# Altium project DC-DC Senior Project.PrjPcb (part 1 of 2)
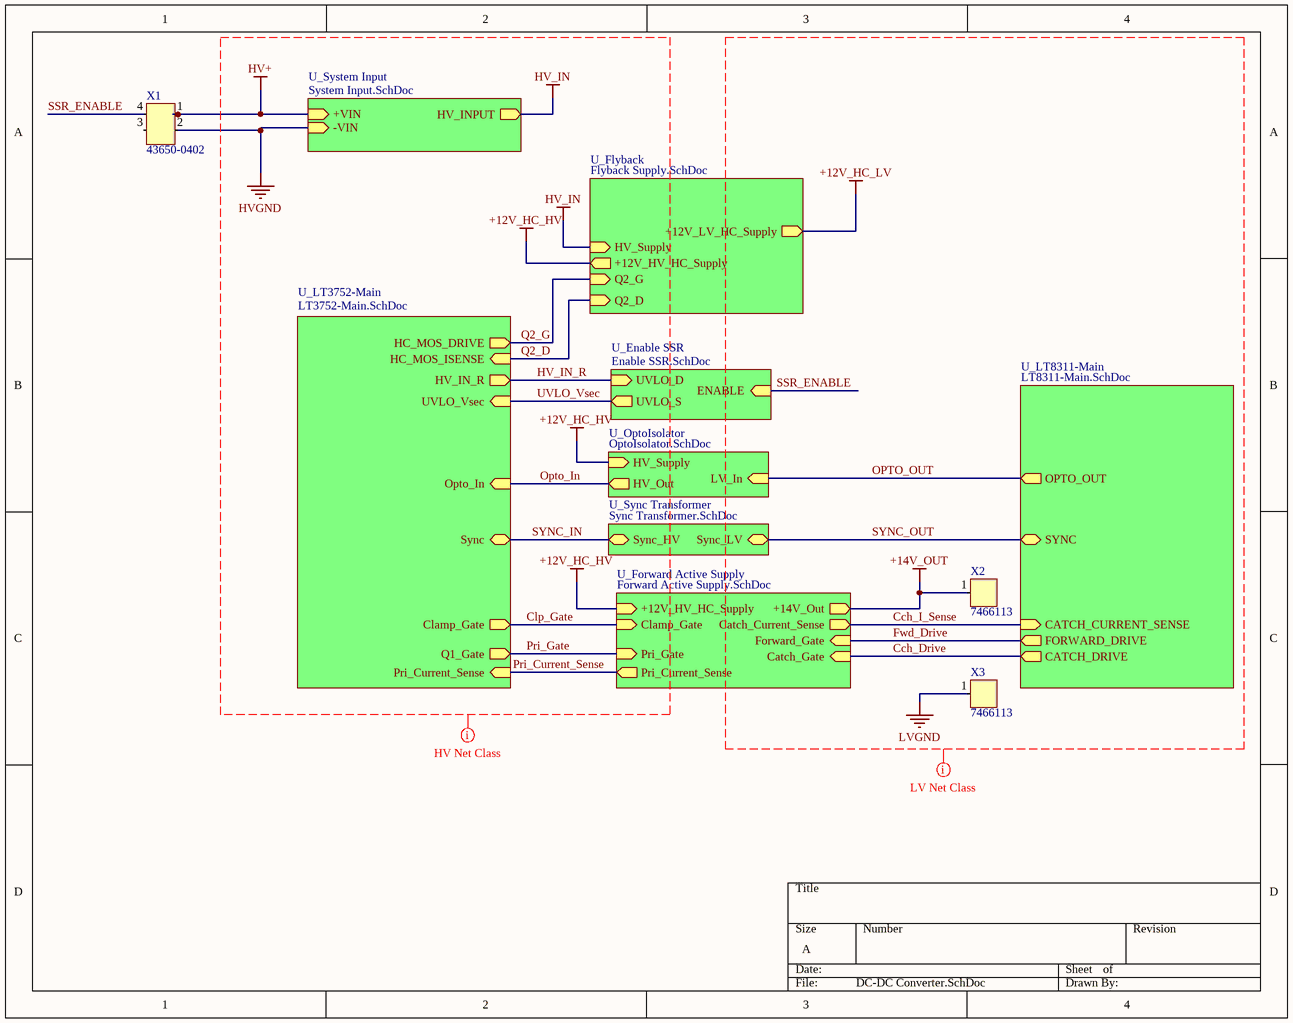
[diagram p0: DC-DC Converter.SchDoc]
10 sheets, 134 parts. Net scope: hierarchical (ports join the sheet entries above them; power ports are global).
Board file: DC-DC Converter.PcbDoc
Sheets:
  DC-DC Converter.SchDoc
    U_Sync Transformer = Sync Transformer.SchDoc
    U_OptoIsolator = OptoIsolator.SchDoc
    U_LT3752-Main = LT3752-Main.SchDoc
    U_LT8311-Main = LT8311-Main.SchDoc
    U_Flyback = Flyback Supply.SchDoc
    U_Forward Active Supply = Forward Active Supply.SchDoc
      U_Gate Driver = Gate Driver.SchDoc
    U_System Input = System Input.SchDoc
    U_Enable SSR = Enable SSR.SchDoc

## Sheet DC-DC Converter.SchDoc
size A

### Parts
X1  43650-0402  [Molex_43650_0402]
X2  7466113  [7466113]
X3  7466113  [7466113]

### Sub-sheets
U_Enable SSR = Enable SSR.SchDoc: UVLO_D (in), ENABLE (in), UVLO_S (out)
U_Flyback = Flyback Supply.SchDoc: +12V_LV_HC_Supply (out), HV_Supply (in), Q2_G (in), +12V_HV_HC_Supply (out), Q2_D (in)
U_Forward Active Supply = Forward Active Supply.SchDoc: Clamp_Gate (in), Pri_Gate (in), Pri_Current_Sense (out), +14V_Out (out), Forward_Gate (in), Catch_Gate (in), Catch_Current_Sense (out), +12V_HV_HC_Supply (in)
U_LT3752-Main = LT3752-Main.SchDoc: Sync (bidir), Opto_In (in), Q1_Gate (out), HC_MOS_DRIVE (out), HC_MOS_ISENSE (in), Clamp_Gate (out), Pri_Current_Sense (in), UVLO_Vsec (in), HV_IN_R (out)
U_LT8311-Main = LT8311-Main.SchDoc: OPTO_OUT (out), CATCH_DRIVE (out), CATCH_CURRENT_SENSE (in), FORWARD_DRIVE (out), SYNC (bidir)
U_OptoIsolator = OptoIsolator.SchDoc: HV_Supply (in), HV_Out (out), LV_In (in)
U_Sync Transformer = Sync Transformer.SchDoc: Sync_LV (bidir), Sync_HV (bidir)
U_System Input = System Input.SchDoc: +VIN (in), -VIN (in), HV_INPUT (out)

### Nets
+12V_HC_HV: sheet U_OptoIsolator/HV_Supply, sheet U_Flyback/+12V_HV_HC_Supply, sheet U_Forward Active Supply/+12V_HV_HC_Supply
+14V_OUT: X2.1 ; sheet U_Forward Active Supply/+14V_Out
HV+: X1.1 ; sheet U_System Input/+VIN
HV_IN: sheet U_Flyback/HV_Supply, sheet U_System Input/HV_INPUT
HVGND: X1.2 ; sheet U_System Input/-VIN
LVGND: X3.1
Cch_Drive: sheet U_LT8311-Main/CATCH_DRIVE, sheet U_Forward Active Supply/Catch_Gate
Cch_I_Sense: sheet U_LT8311-Main/CATCH_CURRENT_SENSE, sheet U_Forward Active Supply/Catch_Current_Sense
Clp_Gate: sheet U_LT3752-Main/Clamp_Gate, sheet U_Forward Active Supply/Clamp_Gate
Fwd_Drive: sheet U_LT8311-Main/FORWARD_DRIVE, sheet U_Forward Active Supply/Forward_Gate
HV_IN_R: sheet U_LT3752-Main/HV_IN_R, sheet U_Enable SSR/UVLO_D
Opto_In: sheet U_OptoIsolator/HV_Out, sheet U_LT3752-Main/Opto_In
OPTO_OUT: sheet U_OptoIsolator/LV_In, sheet U_LT8311-Main/OPTO_OUT
Pri_Current_Sense: sheet U_LT3752-Main/Pri_Current_Sense, sheet U_Forward Active Supply/Pri_Current_Sense
Pri_Gate: sheet U_LT3752-Main/Q1_Gate, sheet U_Forward Active Supply/Pri_Gate
Q2_D: sheet U_LT3752-Main/HC_MOS_ISENSE, sheet U_Flyback/Q2_D
Q2_G: sheet U_LT3752-Main/HC_MOS_DRIVE, sheet U_Flyback/Q2_G
SSR_ENABLE: X1.4 ; sheet U_Enable SSR/ENABLE
SYNC_IN: sheet U_Sync Transformer/Sync_HV, sheet U_LT3752-Main/Sync
SYNC_OUT: sheet U_Sync Transformer/Sync_LV, sheet U_LT8311-Main/SYNC
UVLO_Vsec: sheet U_LT3752-Main/UVLO_Vsec, sheet U_Enable SSR/UVLO_S

Not connected (* = marked no-connect by the designer): X1 3

### Layout directives
net class HV: +12V_HC_HV, Clp_Gate, HV+, HV_IN, HV_IN_R, HVGND, Opto_In, Pri_Current_Sense, Pri_Gate, Q2_D, Q2_G, SYNC_IN, UVLO_Vsec
net class LV: +12V_HC_LV, +14V_OUT, Cch_Drive, Cch_I_Sense, Fwd_Drive, LVGND, OPTO_OUT, SSR_ENABLE, SYNC_OUT

### Library data of the parts
X1 = 6: Manufacturer_id: 4; idConn: 6; Drawer_id: 1; Name: Molex 43650_0402; Value: CONN; Voltage_Rating: 600V; Pitch: 3mm; Created_By: Nick; MfrPartNo: 43650-0402; Num_Contacts: 4; Num_Rows: 1; Package: Conn; Link: https://www.digikey.com/product-detail/en/molex-llc/0436500402/WM11252-ND/3310554; ComponentLink1Description: Datasheet; ComponentLink1URL: https://www.mouser.com/datasheet/2/276/0436500402_PCB_HEADERS-148886.pdf; Supplier1: Digi-Key; Supplier1PartNo: WM11252-ND
X2 X3 = 26: 1 Pin Shank Terminal M3 Surface Mount; Manufacturer_id: 1; idConn: 26; Value: CONN; Created_By: Jason Zhou; Drawer_id: 1; Name: 7466113; Num_Contacts: 1; MfrPartNo: 7466113; Link: https://katalog.we-online.de/en/em/WP-SMSH_PIN; ComponentLink1Description: Datasheet; ComponentLink1URL: https://katalog.we-online.com/em/datasheet/7466113.pdf; Supplier1: Digi-Key; Supplier1PartNo: https://www.digikey.com/product-detail/en/wurth-electronics-inc/7466113/732-5246-ND/4733838; Created_Date: 4/19/2019

## Sheet Sync Transformer.SchDoc
size A
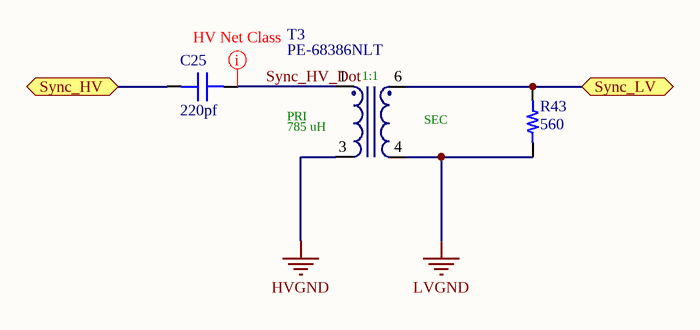
[diagram p1: Sync Transformer.SchDoc]

### Parts
C25  value 220pf  [CAP 0603/1608]  (hidden comment: Capacitor MLCC 220pf 25V CAP 0603/1608)
R43  value 560  [RES 0603/1608]  (hidden comment: Resistor 560 0603 1/10W 1%)
T3  Sync Transformer  [PE-68386NLT]  (value not drawn)

### Ports
Sync_HV (bidir), Sync_LV (bidir)

### Nets
HVGND: T3.3
LVGND: R43.1 T3.4
Sync_HV_Dot: C25.2 T3.1
SYNC_IN: C25.1 ; port Sync_HV
SYNC_OUT: R43.2 T3.6 ; port Sync_LV

### Layout directives
net class HV: Sync_HV_Dot

### Notes on the sheet
- (in symbol 2) 1:1; PRI; SEC; 785 uH

### Library data of the parts
C25 = 537: Manufacturer_id: 1; idCapacitor: 537; Name: Cap_220pf_25V_CAP 0603/1608; Dielectric: Ceramic; Created_By: Nick Mah; Drawer_id: 1; Voltage_Rating: 25V; Package: CAP 0603/1608; Created_Date: 10/20/2018
R43 = 283: Manufacturer_id: 1; idResistor: 283; Name: Res_560_0603_1/10W_1%; Created_By: Nick Mah; Supplier 1: Digi-Key; Drawer_id: 1; Tolerance: 1%; Power: 1/10W; Package: 0603; ComponentLink1Description: Datasheet; Created_Date: 2018-10-20
T3 = 2: PULSE XFMR 1:1 785UH; Manufacturer_id: 1; idTransformer: 2; Name: 500W DC-DC Sync Trfrmr; Value: 785uH - 1:1; Voltage_Primary: 380Vrms; Created_By: Nick Mah; Drawer_id: 1; Package: SMD; MfrPartNo: PE-68386NLT; Link: https://www.digikey.com/product-detail/en/pulse-electronics-power/PE-68386NLT/553-1776-1-ND/4494729; ComponentLink1Description: Datasheet; ComponentLink1URL: file:///C:/Users/Nick%20Mah/Downloads/SPM2007_61.pdf; Supplier1: Digi-Key; Supplier1PartNo: 553-1776-1-ND

## Sheet OptoIsolator.SchDoc
size A
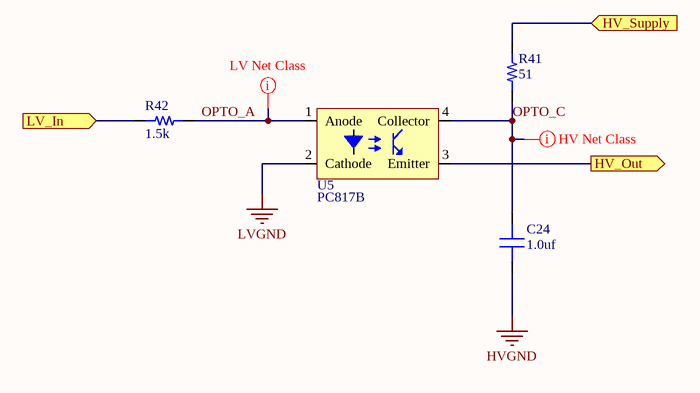
[diagram p2: OptoIsolator.SchDoc]

### Parts
C24  value 1.0uf  [CAP 0603/1608]  (hidden comment: Capacitor MLCC 1.0uf 25V CAP 0603/1608)
R41  value 51  [RES 0805/2012]  (hidden comment: Resistor 51 0805 1/4W 1%)
R42  value 1.5k  [RES 0603/1608]  (hidden comment: Resistor 1.5k 0603 1/10W 1%)
U5  PC817B  [SOIC-4]

### Ports
HV_Out (out), HV_Supply (in), LV_In (in)

### Nets
+12V_HC_HV: R41.2 ; port HV_Supply
HVGND: C24.1
LVGND: U5.2(Cathode)
OPTO_A: R42.2 U5.1(Anode)
OPTO_C: C24.2 R41.1 U5.4(Collector)
Opto_In: U5.3(Emitter) ; port HV_Out
OPTO_OUT: R42.1 ; port LV_In

### Layout directives
mark named LV Net Class: OPTO_A
net class HV: OPTO_C

### Library data of the parts
C24 = 589: Manufacturer_id: 1; idCapacitor: 589; Name: Cap_1.0uf_25V_CAP 0603/1608; Dielectric: Ceramic; Created_By: Nick Mah; Drawer_id: 1; Voltage_Rating: 25V; Package: CAP 0603/1608; Created_Date: 10/20/2018
R41 = 690: Manufacturer_id: 1; idResistor: 690; Name: Res_51_0805_1/4W_1%; Created_By: Nick Mah; Supplier 1: Digi-Key; Drawer_id: 1; Tolerance: 1%; Power: 1/4W; Package: 0805; ComponentLink1Description: Datasheet; Created_Date: 2018-10-20
R42 = 293: Manufacturer_id: 1; idResistor: 293; Name: Res_1.5k_0603_1/10W_1%; Created_By: Nick Mah; Supplier 1: Digi-Key; Drawer_id: 1; Tolerance: 1%; Power: 1/10W; Package: 0603; ComponentLink1Description: Datasheet; Created_Date: 2018-10-20
U5 = 36: Optoisolator Darlington Output 2500Vrms 1 Channel 4-SSOP; Manufacturer_id: 1; idIC_Misc: 36; Name: PS2802-1-A; Value: 90mA, 40VCe; Protocol: Null; Vin(Max): 80V Vce; Created_By: Nick Mah; Drawer_id: 1; Type: Optoisolator; Num_Circuits: 1; Package: SOIC-4; MfrPartNo: PS2802-1-A; Link: https://www.digikey.com/product-detail/en/renesas-electronics-america/PS2802-1-A/559-1102-ND/9564743; ComponentLink1Description: Datasheet; ComponentLink1URL: https://www.renesas.com/en-us/doc/YOUSYS/document/002/PN10252EJ02V0DS.pdf; Supplier1: Digi-Key; Supplier1PartNo: 559-1102-ND

## Sheet LT3752-Main.SchDoc
size A
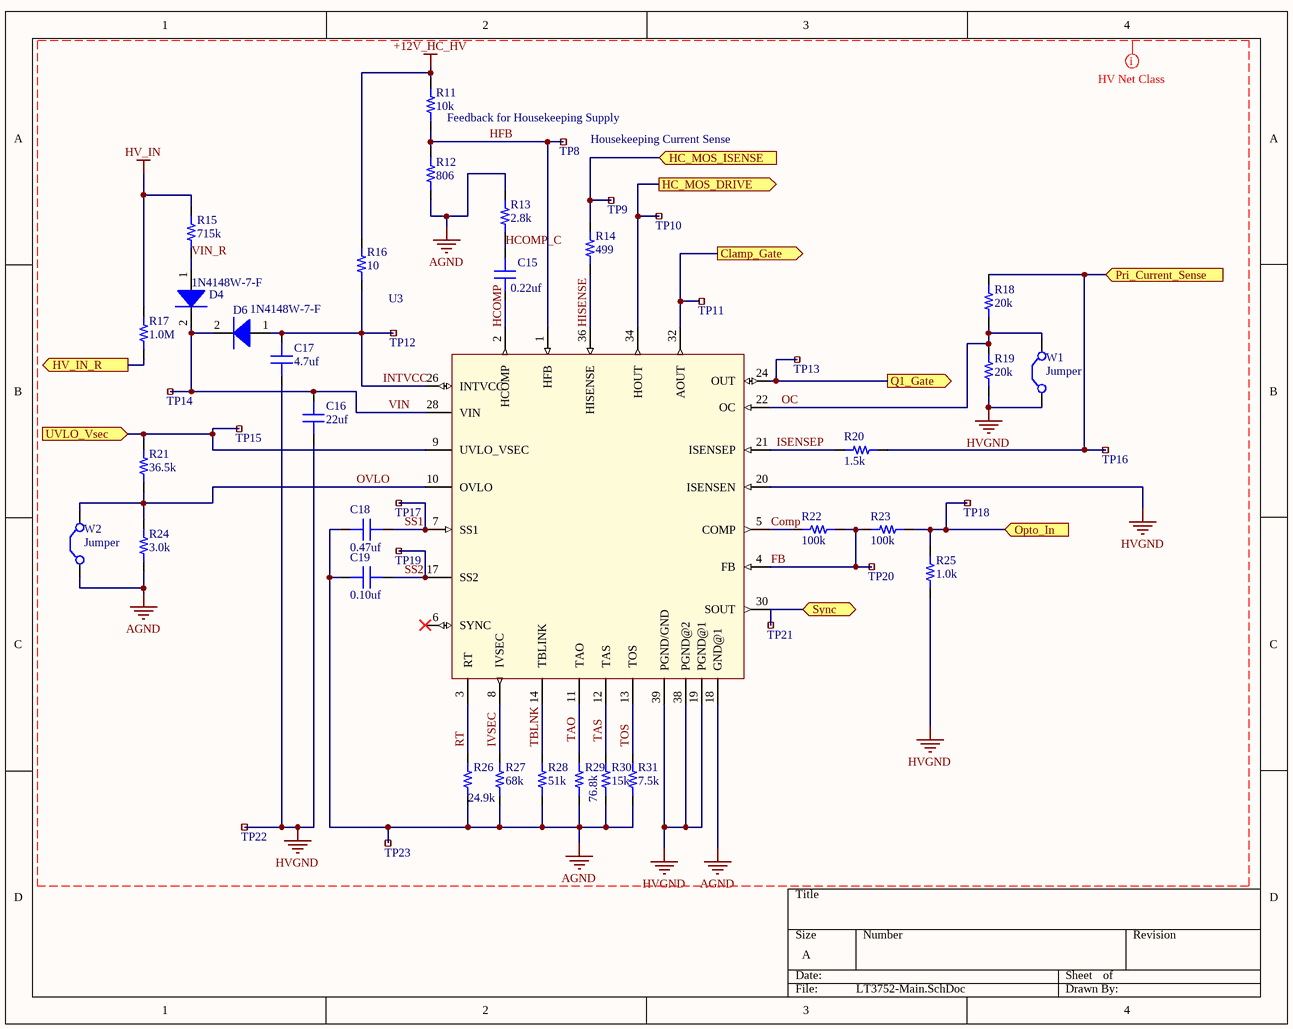
[diagram p3: LT3752-Main.SchDoc]

### Parts
C15  value 0.22uf  [CAP 0603/1608]  (hidden comment: Capacitor MLCC 0.22uf 25V CAP 0603/1608)
C16  value 22uf  [CAP 0805/2012]  (hidden comment: Capacitor MLCC 22uf 25V CAP 0805/2012)
C17  value 4.7uf  [CAP 0805/2012]  (hidden comment: Capacitor MLCC 4.7uf 25V CAP 0805/2012)
C18  value 0.47uf  [CAP 0603/1608]  (hidden comment: Capacitor MLCC 0.47uf 25V CAP 0603/1608)
C19  value 0.10uf  [CAP 0603/1608]  (hidden comment: Capacitor MLCC 0.10uf 25V CAP 0603/1608)
D4  mfrpartno: 1N4148W-7-F  [SOD123F]
D6  mfrpartno: 1N4148W-7-F  [SOD123F]
R11  value 10k  [RES 0603/1608]  (hidden comment: Resistor 10k 0603 1/10W 1%)
R12  value 806  [RES 0603/1608]  (hidden comment: Resistor 806 0603 1/10W 1%)
R13  value 2.8k  [RES 0603/1608]  (hidden comment: Resistor 2.8k 0603 1/10W 1%)
R14  value 499  [RES 0603/1608]  (hidden comment: Resistor 499 0603 1/10W 1%)
R15  value 715k  [RES 1206/3216]  (hidden comment: Resistor 715k 1206 1/4W 1%)
R16  value 10  [RES 0805/2012]  (hidden comment: Resistor 10 0805 1/4W 10%)
R17  value 1.0M  [RES 0603/1608]  (hidden comment: Resistor 1.0M 0603 1/10W 1%)
R18  value 20k  [RES 0603/1608]  (hidden comment: Resistor 20k 0603 1/10W 1%)
R19  value 20k  [RES 0603/1608]  (hidden comment: Resistor 20k 0603 1/10W 1%)
R20  value 1.5k  [RES 0603/1608]  (hidden comment: Resistor 1.5k 0603 1/10W 1%)
R21  value 36.5k  [RES 0603/1608]  (hidden comment: Resistor 36.5k 0603 1/10W 1%)
R22  value 100k  [RES 0603/1608]  (hidden comment: Resistor 100k 0603 1/10W 1%)
R23  value 100k  [RES 0603/1608]  (hidden comment: Resistor 100k 0603 1/10W 1%)
R24  value 3.0k  [RES 0603/1608]  (hidden comment: Resistor 3.0k 0603 1/10W 1%)
R25  value 1.0k  [RES 0805/2012]  (hidden comment: Resistor 1.0k 0805 1/4W 5%)
R26  value 24.9k  [RES 0603/1608]  (hidden comment: Resistor 24.9k 0603 1/10W 1%)
R27  value 68k  [RES 0603/1608]  (hidden comment: Resistor 68k 0603 1/10W 1%)
R28  value 51k  [RES 0603/1608]  (hidden comment: Resistor 51k 0603 1/10W 1%)
R29  value 76.8k  [RES 0603/1608]  (hidden comment: Resistor 76.8k 0603 1/10 1%)
R30  value 15k  [RES 0603/1608]  (hidden comment: Resistor 15k 0603 1/10W 1%)
R31  value 7.5k  [RES 0603/1608]  (hidden comment: Resistor 7.5k 0603 1/10W 1%)
TP8  RCU-0C  [5029]  (value not drawn)
TP9  RCU-0C  [5029]  (value not drawn)
TP10  RCU-0C  [5029]  (value not drawn)
TP11  RCU-0C  [5029]  (value not drawn)
TP12  RCU-0C  [5029]  (value not drawn)
TP13  RCU-0C  [5029]  (value not drawn)
TP14  RCU-0C  [5029]  (value not drawn)
TP15  RCU-0C  [5029]  (value not drawn)
TP16  RCU-0C  [5029]  (value not drawn)
TP17  RCU-0C  [5029]  (value not drawn)
TP18  RCU-0C  [5029]  (value not drawn)
TP19  RCU-0C  [5029]  (value not drawn)
TP20  RCU-0C  [5029]  (value not drawn)
TP21  RCU-0C  [5029]  (value not drawn)
TP22  RCU-0C  [5029]  (value not drawn)
TP23  RCU-0C  [5029]  (value not drawn)
U3  (no value)  [TSSOP-38]
W1  Jumper  [XG8T-0231]
W2  Jumper  [XG8T-0231]

### Ports
Clamp_Gate (out), HC_MOS_DRIVE (out), HC_MOS_ISENSE (in), HV_IN_R (out), Opto_In (in), Pri_Current_Sense (in), Q1_Gate (out), Sync (bidir), UVLO_Vsec (in)

### Nets
+12V_HC_HV: R11.1 R16.1
AGND: C18.1 C19.1 R12.1 R13.2 R24.1 R26.1 R27.1 R28.1 R29.1 R30.1 R31.1 TP23.1 U3.18(GND@1) W2.1(C1)
HV_IN: R15.2 R17.1
HVGND: C16.1 C17.1 R19.1 R25.1 TP22.1 U3.19(PGND@1) U3.20(ISENSEN) U3.38(PGND@2) U3.39(PGND/GND) W1.1(C1)
Clp_Gate: TP11.1 U3.32(AOUT) ; port Clamp_Gate
Comp: R22.1 U3.5(COMP)
FB: R22.2 R23.1 TP20.1 U3.4(FB)
HCOMP: C15.1 U3.2(HCOMP)
HCOMP_C: C15.2 R13.1
HFB: R11.2 R12.2 TP8.1 U3.1(HFB)
HISENSE: R14.1 U3.36(HISENSE)
HV_IN_R: R17.2 ; port HV_IN_R
INTVCC: C17.2 D6.1(A) R16.2 TP12.1 U3.26(INTVCC)
ISENSEP: R20.1 U3.21(ISENSEP)
IVSEC: R27.2 U3.8(IVSEC)
OC: R18.1 R19.2 U3.22(OC) W1.2(C2)
Opto_In: R23.2 R25.2 TP18.1 ; port Opto_In
OVLO: R21.1 R24.2 U3.10(OVLO) W2.2(C2)
Pri_Current_Sense: R18.2 R20.2 TP16.1 ; port Pri_Current_Sense
Pri_Gate: TP13.1 U3.24(OUT) ; port Q1_Gate
Q2_D: R14.2 TP9.1 ; port HC_MOS_ISENSE
Q2_G: TP10.1 U3.34(HOUT) ; port HC_MOS_DRIVE
RT: R26.2 U3.3(RT)
SS1: C18.2 TP17.1 U3.7(SS1)
SS2: C19.2 TP19.1 U3.17(SS2)
SYNC_IN: TP21.1 U3.30(SOUT) ; port Sync
TAO: R29.2 U3.11(TAO)
TAS: R30.2 U3.12(TAS)
TBLNK: R28.2 U3.14(TBLINK)
TOS: R31.2 U3.13(TOS)
UVLO_Vsec: R21.2 TP15.1 U3.9(UVLO_VSEC) ; port UVLO_Vsec
VIN: C16.2 D4.2(K) D6.2(K) TP14.1 U3.28(VIN)
VIN_R: D4.1(A) R15.1

Not connected (* = marked no-connect by the designer): U3 6(SYNC)*

### Layout directives
net class HV: +12V_HC_HV, AGND, Comp, FB, HCOMP, HCOMP_C, HFB, HISENSE, HV_IN, HVGND, INTVCC, ISENSEP, IVSEC, OC, OVLO, RT, SS1, SS2, TAO, TAS, TBLNK, TOS, VIN, VIN_R

### Notes on the sheet
- Feedback for Housekeeping Supply
- (near TP8) Housekeeping Current Sense

### Library data of the parts
C15 = 585: Manufacturer_id: 1; idCapacitor: 585; Name: Cap_0.22uf_25V_CAP 0603/1608; Dielectric: Ceramic; Created_By: Nick Mah; Drawer_id: 1; Voltage_Rating: 25V; Package: CAP 0603/1608; Created_Date: 10/20/2018
C16 = 717: Manufacturer_id: 1; idCapacitor: 717; Name: Cap_22uf_25V_CAP 0805/2012; Dielectric: Ceramic; Created_By: Nick Mah; Drawer_id: 1; Voltage_Rating: 25V; Package: CAP 0805/2012; Created_Date: 10/20/2018
C17 = 713: Manufacturer_id: 1; idCapacitor: 713; Name: Cap_4.7uf_25V_CAP 0805/2012; Dielectric: Ceramic; Created_By: Nick Mah; Drawer_id: 1; Voltage_Rating: 25V; Package: CAP 0805/2012; Created_Date: 10/20/2018
C18 = 587: Manufacturer_id: 1; idCapacitor: 587; Name: Cap_0.47uf_25V_CAP 0603/1608; Dielectric: Ceramic; Created_By: Nick Mah; Drawer_id: 1; Voltage_Rating: 25V; Package: CAP 0603/1608; Created_Date: 10/20/2018
C19 = 583: Manufacturer_id: 1; idCapacitor: 583; Name: Cap_0.10uf_25V_CAP 0603/1608; Dielectric: Ceramic; Created_By: Nick Mah; Drawer_id: 1; Voltage_Rating: 25V; Package: CAP 0603/1608; Created_Date: 10/20/2018
D4 D6 = 4: 100V Reverse DC Voltage; Manufacturer_id: 1; idDiode: 4; Value: Vf-1.25V,Vr-100V; Type: Standard; Ic: 300 mA; Drawer_id: 1; Name: 1N4148W-7-F; Num_Circuits: 1; Package: SOD123; Link: https://www.digikey.com/product-detail/en/diodes-incorporated/1N4148W-7-F/1N4148W-FDICT-ND/815280
R11 = 313: Manufacturer_id: 1; idResistor: 313; Name: Res_10k_0603_1/10W_1%; Created_By: Nick Mah; Supplier 1: Digi-Key; Drawer_id: 1; Tolerance: 1%; Power: 1/10W; Package: 0603; ComponentLink1Description: Datasheet; Created_Date: 2018-10-20
R12 = 2720: Manufacturer_id: 1; idResistor: 2720; Name: Res_806_0603_1/10W_1%; Created_By: Nick Mah; Supplier 1: Digi-Key; Supplier Part Number 1: Digi-Key; Drawer_id: 1; Tolerance: 1%; Power: 1/10W; Package: 0603; ComponentLink1Description: Datasheet
R13 = 2722: Manufacturer_id: 1; idResistor: 2722; Name: Res_2.8k_0603_1/10W_1%; Created_By: Nick Mah; Supplier 1: Digi-Key; Supplier Part Number 1: Digi-Key; Drawer_id: 1; Tolerance: 1%; Power: 1/10W; Package: 0603; ComponentLink1Description: Datasheet
R14 = 2723: Manufacturer_id: 1; idResistor: 2723; Name: Res_499_1/10W_1%; Created_By: Nick Mah; Supplier 1: Digi-Key; Supplier Part Number 1: Digi-Key; Drawer_id: 1; Tolerance: 1%; Power: 1/10W; Package: 0603; ComponentLink1Description: Datasheet
R15 = 2719: Manufacturer_id: 1; idResistor: 2719; Name: Res_715k_1206_1/4W_1; Created_By: Nick Mah; Supplier 1: Digi-Key; Supplier Part Number 1: Digi-Key; Drawer_id: 1; Tolerance: 1%; Power: 1/4W; Package: 1206; ComponentLink1Description: Datasheet
R16 = 2497: Manufacturer_id: 1; idResistor: 2497; Name: Res_10_0805_1/4W_10%; Created_By: Nick Mah; Supplier 1: Digi-Key; Drawer_id: 1; Tolerance: 10%; Power: 1/4W; Package: 0805; ComponentLink1Description: Datasheet; Created_Date: 2018-10-20
R17 = 361: Manufacturer_id: 1; idResistor: 361; Name: Res_1.0M_0603_1/10W_1%; Created_By: Nick Mah; Supplier 1: Digi-Key; Drawer_id: 1; Tolerance: 1%; Power: 1/10W; Package: 0603; ComponentLink1Description: Datasheet; Created_Date: 2018-10-20
R18 R19 = 320: Manufacturer_id: 1; idResistor: 320; Name: Res_20k_0603_1/10W_1%; Created_By: Nick Mah; Supplier 1: Digi-Key; Drawer_id: 1; Tolerance: 1%; Power: 1/10W; Package: 0603; ComponentLink1Description: Datasheet; Created_Date: 2018-10-20
R20 = 293: as R42 on sheet OptoIsolator; Supplier 1: Digi-Key; Drawer_id: 1; Tolerance: 1%; Power: 1/10W; Package: 0603; ComponentLink1Description: Datasheet; Created_Date: 2018-10-20
R21 = 2718: Manufacturer_id: 1; idResistor: 2718; Name: Res_36.5k_0603_1/10W_1%; Created_By: Nick Mah; Supplier 1: Digi-Key; Supplier Part Number 1: Digi-Key; Drawer_id: 1; Tolerance: 1%; Power: 1/10W; Package: 0603; ComponentLink1Description: Datasheet
R22 R23 = 337: Manufacturer_id: 1; idResistor: 337; Name: Res_100k_0603_1/10W_1%; Created_By: Nick Mah; Supplier 1: Digi-Key; Drawer_id: 1; Tolerance: 1%; Power: 1/10W; Package: 0603; ComponentLink1Description: Datasheet; Created_Date: 2018-10-20
R24 = 300: Manufacturer_id: 1; idResistor: 300; Name: Res_3.0k_0603_1/10W_1%; Created_By: Nick Mah; Supplier 1: Digi-Key; Drawer_id: 1; Tolerance: 1%; Power: 1/10W; Package: 0603; ComponentLink1Description: Datasheet; Created_Date: 2018-10-20
R25 = 1801: Manufacturer_id: 1; idResistor: 1801; Name: Res_1.0k_0805_1/4W_5%; Created_By: Nick Mah; Supplier 1: Digi-Key; Drawer_id: 1; Tolerance: 5%; Power: 1/4W; Package: 0805; ComponentLink1Description: Datasheet; Created_Date: 2018-10-20
R26 = 2716: Manufacturer_id: 1; idResistor: 2716; Name: Res_24.9k_0603_1/10W_1%; Created_By: Nick Mah; Supplier 1: Digi-Key; Supplier Part Number 1: Digi-Key; Drawer_id: 1; Tolerance: 1%; Power: 1/10W; Package: 0603; ComponentLink1Description: Datasheet
R27 = 333: Manufacturer_id: 1; idResistor: 333; Name: Res_68k_0603_1/10W_1%; Created_By: Nick Mah; Supplier 1: Digi-Key; Drawer_id: 1; Tolerance: 1%; Power: 1/10W; Package: 0603; ComponentLink1Description: Datasheet; Created_Date: 2018-10-20
R28 = 330: Manufacturer_id: 1; idResistor: 330; Name: Res_51k_0603_1/10W_1%; Created_By: Nick Mah; Supplier 1: Digi-Key; Drawer_id: 1; Tolerance: 1%; Power: 1/10W; Package: 0603; ComponentLink1Description: Datasheet; Created_Date: 2018-10-20
R29 = 2717: Manufacturer_id: 1; idResistor: 2717; Name: Res_76.8k_0603_1/10W_1%; Power: 1/10W; Created_By: Nick Mah; Supplier 1: Digi-Key; Supplier Part Number 1: Digi-Key; Drawer_id: 1; Tolerance: 1%; Package: 0603; ComponentLink1Description: Datasheet
R30 = 317: Manufacturer_id: 1; idResistor: 317; Name: Res_15k_0603_1/10W_1%; Created_By: Nick Mah; Supplier 1: Digi-Key; Drawer_id: 1; Tolerance: 1%; Power: 1/10W; Package: 0603; ComponentLink1Description: Datasheet; Created_Date: 2018-10-20
R31 = 310: Manufacturer_id: 1; idResistor: 310; Name: Res_7.5k_0603_1/10W_1%; Created_By: Nick Mah; Supplier 1: Digi-Key; Drawer_id: 1; Tolerance: 1%; Power: 1/10W; Package: 0603; ComponentLink1Description: Datasheet; Created_Date: 2018-10-20
TP8-TP23 = 28: Test point; Manufacturer_id: 1; idConn: 28; Value: CONN; Created_By: Jason Zhou; Drawer_id: 1; Name: 5029; Num_Contacts: 1; Num_Rows: 1; Package: 5029; MfrPartNo: 5029; Link: https://www.digikey.com/product-detail/en/keystone-electronics/5029/36-5029CT-ND/5980631; ComponentLink1Description: Datasheet; ComponentLink1URL: file:///C:/Users/Jason%20Zhou/Downloads/5029.PDF; Supplier1: Digi-Key; Supplier1PartNo: 36-5029CT-ND; Created_Date: 4/26/2019
U3 = 3: Forward Converter Regulator Positive, Isolation Capable Output Step-Up/Step-Down DC-DC Controller IC 6.5-100V Input; Manufacturer_id: 1; MfrPartNo: LT3752FE-1; MF: Linear Technology/Analog; MP: LT3752EFE-1#PBF; idPMIC_SW: 3; Name: LT3752-1 DC-DC Converter; Discrete: No; Power: 400W; Topology: Isolated Forward; Vin(Min): 6.5V; Vin(Max): 100V; Vout_Type: Adjustable; Fs: 100-500kHz; Created_By: Jason; Availability: Unavailable; Price: None; Package: 38-TSSOP; SnapEDA_Link: https://www.snapeda.com/parts/LT3752EFE-1%23PBF/Analog%20Devices/view-part/?ref=snap; Value: Forward; Drawer_id: 1; Num_Outputs: 1; Link: https://www.digikey.com/product-detail/en/linear-technology-analog-devices/LT3752EFE-1-PBF/LT3752EFE-1-PBF-ND/4814575; ComponentLink1Description: Datasheet; ComponentLink1URL: https://www.analog.com/media/en/technical-documentation/data-sheets/8311f.pdf; Supplier1: Digi-Key; Supplier1PartNo: LT3752EFE-1#PBF-ND
W1 W2 = 18: Jumper headers; Manufacturer_id: 1; idFuse: 3; idConn: 18; Num_Contacts: 2; Pitch: .1 mm; Drawer_id: 1; Name: XG8T-0231; Value: Jumper; Num_Rows: 1; MfrPartNo: XG8T-0231; Link: https://www.digikey.ca/product-detail/en/omron-electronics-inc-emc-div/XG8T-0231/XG8T-0231-ND/1829453; ComponentLink1Description: Datasheet; Supplier1: Digi-Key

## Sheet LT8311-Main.SchDoc
size A
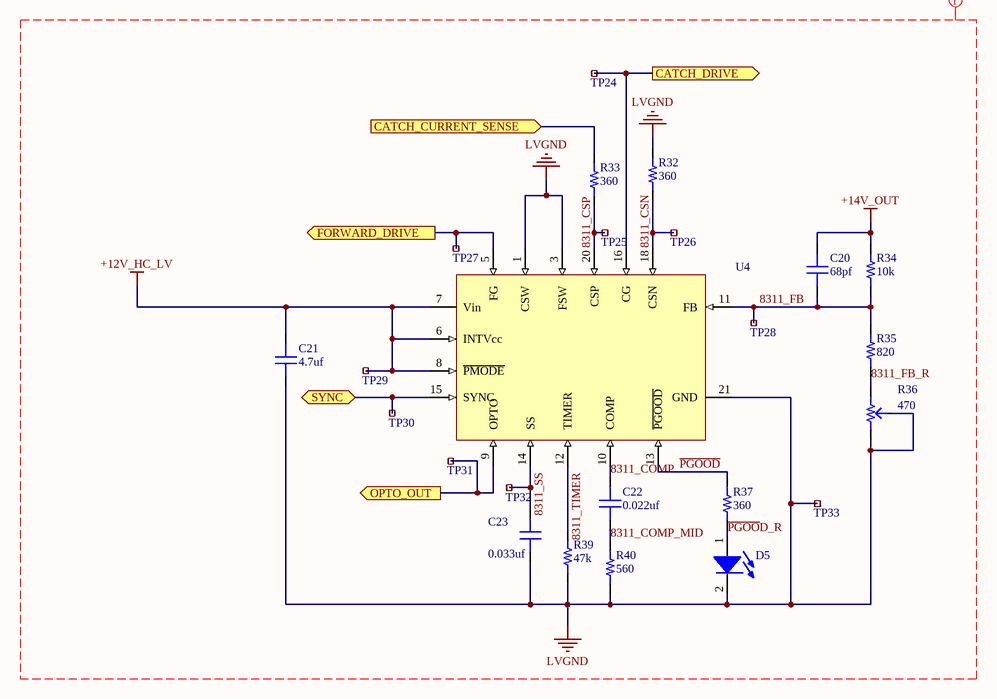
[diagram p4: LT8311-Main.SchDoc]

### Parts
C20  value 68pf  [CAP 0603/1608]  (hidden comment: Capacitor MLCC 68pf 25V CAP 0603/1608)
C21  value 4.7uf  [CAP 0805/2012]  (hidden comment: Capacitor MLCC 4.7uf 25V CAP 0805/2012)
C22  value 0.022uf  [CAP 0603/1608]  (hidden comment: Capacitor MLCC 0.022uf 16V CAP 0603/1608)
C23  value 0.033uf  [CAP 0603/1608]  (hidden comment: Capacitor MLCC 0.033uf 16V CAP 0603/1608)
D5  (no value)  [0805_LED]
R32  value 360  [RES 0603/1608]  (hidden comment: Resistor 360 0603 1/10W 1%)
R33  value 360  [RES 0603/1608]  (hidden comment: Resistor 360 0603 1/10W 1%)
R34  value 10k  [RES 0603/1608]  (hidden comment: Resistor 10k 0603 1/10W 1%)
R35  value 820  [RES 0603/1608]  (hidden comment: Resistor 820 0603 1/10W 1%)
R36  value 470  [PT6WV]  (hidden comment: TRIMMER 470 OHM LINEAR)
R37  value 360  [RES 0603/1608]  (hidden comment: Resistor 360 0603 1/10W 1%)
R39  value 47k  [RES 0603/1608]  (hidden comment: Resistor 47k 0603 1/10W 1%)
R40  value 560  [RES 0603/1608]  (hidden comment: Resistor 560 0603 1/10W 1%)
TP24  RCU-0C  [5029]  (value not drawn)
TP25  RCU-0C  [5029]  (value not drawn)
TP26  RCU-0C  [5029]  (value not drawn)
TP27  RCU-0C  [5029]  (value not drawn)
TP28  RCU-0C  [5029]  (value not drawn)
TP29  RCU-0C  [5029]  (value not drawn)
TP30  RCU-0C  [5029]  (value not drawn)
TP31  RCU-0C  [5029]  (value not drawn)
TP32  RCU-0C  [5029]  (value not drawn)
TP33  RCU-0C  [5029]  (value not drawn)
U4  (no value)  [FE20(16)]

### Ports
CATCH_CURRENT_SENSE (in), CATCH_DRIVE (out), FORWARD_DRIVE (out), OPTO_OUT (out), SYNC (bidir)

### Nets
+12V_HC_LV: C21.2 TP29.1 U4.6(INTVcc) U4.7(Vin) U4.8(~{PMODE})
+14V_OUT: C20.2 R34.2
LVGND: C21.1 C23.2 D5.2(K) R32.2 R36.2 R39.1 R40.1 TP33.1 U4.1(CSW) U4.3(FSW) U4.21(GND)
8311_COMP: C22.2 U4.10(COMP)
8311_COMP_MID: C22.1 R40.2
8311_CSN: R32.1 TP26.1 U4.18(CSN)
8311_CSP: R33.1 TP25.1 U4.20(CSP)
8311_FB: C20.1 R34.1 R35.2 TP28.1 U4.11(FB)
8311_FB_R: R35.1 R36.1
8311_SS: C23.1 TP32.1 U4.14(SS)
8311_TIMER: R39.2 U4.12(TIMER)
Cch_Drive: TP24.1 U4.16(CG) ; port CATCH_DRIVE
Cch_I_Sense: R33.2 ; port CATCH_CURRENT_SENSE
Fwd_Drive: TP27.1 U4.5(FG) ; port FORWARD_DRIVE
OPTO_OUT: TP31.1 U4.9(OPTO) ; port OPTO_OUT
~{PGOOD}: R37.2 U4.13(~{PGOOD})
~{PGOO}D_R: D5.1(A) R37.1
SYNC_OUT: TP30.1 U4.15(SYNC) ; port SYNC

Not connected (* = marked no-connect by the designer): R36 3

### Layout directives
net class LV: 8311_COMP, 8311_COMP_MID, 8311_CSN, 8311_CSP, 8311_FB, 8311_FB_R, 8311_SS, 8311_TIMER, +12V_HC_LV, +14V_OUT, LVGND, ~{PGOOD}, ~{PGOO}D_R

### Library data of the parts
C20 = 525: Manufacturer_id: 1; idCapacitor: 525; Name: Cap_68pf_25V_CAP 0603/1608; Dielectric: Ceramic; Created_By: Nick Mah; Drawer_id: 1; Voltage_Rating: 25V; Package: CAP 0603/1608; Created_Date: 10/20/2018
C21 = 713: as C17 on sheet LT3752-Main; Drawer_id: 1; Voltage_Rating: 25V; Package: CAP 0805/2012; Created_Date: 10/20/2018
C22 = 219: Manufacturer_id: 1; idCapacitor: 219; Name: Cap_0.022uf_16V_CAP 0603/1608; Dielectric: Ceramic; Created_By: Nick Mah; Drawer_id: 1; Voltage_Rating: 16V; Package: CAP 0603/1608; Created_Date: 10/20/2018
C23 = 220: Manufacturer_id: 1; idCapacitor: 220; Name: Cap_0.033uf_16V_CAP 0603/1608; Dielectric: Ceramic; Created_By: Nick Mah; Drawer_id: 1; Voltage_Rating: 16V; Package: CAP 0603/1608; Created_Date: 10/20/2018
D5 = 1: idLED: 1; Name: LED_0805_RED; Value: Red; Vf: 0.7V; Manufacturer_id: 1; Drawer_id: 1; Package: 0805
R32 R33 R37 = 278: Manufacturer_id: 1; idResistor: 278; Name: Res_360_0603_1/10W_1%; Created_By: Nick Mah; Supplier 1: Digi-Key; Drawer_id: 1; Tolerance: 1%; Power: 1/10W; Package: 0603; ComponentLink1Description: Datasheet; Created_Date: 2018-10-20
R34 = 313: as R11 on sheet LT3752-Main; Supplier 1: Digi-Key; Drawer_id: 1; Tolerance: 1%; Power: 1/10W; Package: 0603; ComponentLink1Description: Datasheet; Created_Date: 2018-10-20
R35 = 287: Manufacturer_id: 1; idResistor: 287; Name: Res_820_0603_1/10W_1%; Created_By: Nick Mah; Supplier 1: Digi-Key; Drawer_id: 1; Tolerance: 1%; Power: 1/10W; Package: 0603; ComponentLink1Description: Datasheet; Created_Date: 2018-10-20
R36 = 2715: 470 Ohm 1 Gang Linear Through Hole Potentiometer None 1 Turn Carbon 0.1W, 1/10W PC Pins; Manufacturer_id: 1; idResistor: 2715; Name: PT6WV-471A2020; Tolerance: 20%; Created_By: Nick Mah; Supplier 1: Digi-Key; Supplier Part Number 1: 1993-1025-ND; Drawer_id: 1; Power: 1/10W; Package: TH; MfrPartNo: PT6WV-471A2020; Link: https://www.digikey.com/product-detail/en/amphenol-piher-sensing-systems/PT6WV-471A2020/1993-1025-ND/9555863; ComponentLink1Description: Datasheet; ComponentLink1URL: https://www.mouser.com/datasheet/2/18/11-PT6v03-1499160.pdf
R39 = 329: Manufacturer_id: 1; idResistor: 329; Name: Res_47k_0603_1/10W_1%; Created_By: Nick Mah; Supplier 1: Digi-Key; Drawer_id: 1; Tolerance: 1%; Power: 1/10W; Package: 0603; ComponentLink1Description: Datasheet; Created_Date: 2018-10-20
R40 = 283: as R43 on sheet Sync Transformer; Supplier 1: Digi-Key; Drawer_id: 1; Tolerance: 1%; Power: 1/10W; Package: 0603; ComponentLink1Description: Datasheet; Created_Date: 2018-10-20
TP24-TP33 = 28: as TP8 on sheet LT3752-Main; Drawer_id: 1; Name: 5029; Num_Contacts: 1; Num_Rows: 1; Package: 5029; MfrPartNo: 5029; Link: https://www.digikey.com/product-detail/en/keystone-electronics/5029/36-5029CT-ND/5980631; ComponentLink1Description: Datasheet; ComponentLink1URL: file:///C:/Users/Jason%20Zhou/Downloads/5029.PDF; Supplier1: Digi-Key; Supplier1PartNo: 36-5029CT-ND; Created_Date: 4/26/2019
U4 = 4: Power Supply Controller Secondary-Side Controller; Manufacturer_id: 1; MfrPartNo: LT8311FE; idPMIC_SW: 4; Name: LT8311 MOSFET Driver; Value: Secondary Side Controller; Discrete: No; Topology: Synchronous Rectifier; Vout_Type: Adjustable; Created_By: Jason; Drawer_id: 1; Num_Outputs: 1; Package: 20-TSSOP; Link: https://www.digikey.com/product-detail/en/linear-technology-analog-devices/LT8311HFE-PBF/LT8311HFE-PBF-ND/4808890; ComponentLink1Description: Datasheet; ComponentLink1URL: https://www.analog.com/media/en/technical-documentation/data-sheets/8311f.pdf; Supplier1: Digi-Key; Supplier1PartNo: LT8311HFE#PBF-ND

## Sheet Flyback Supply.SchDoc
size A
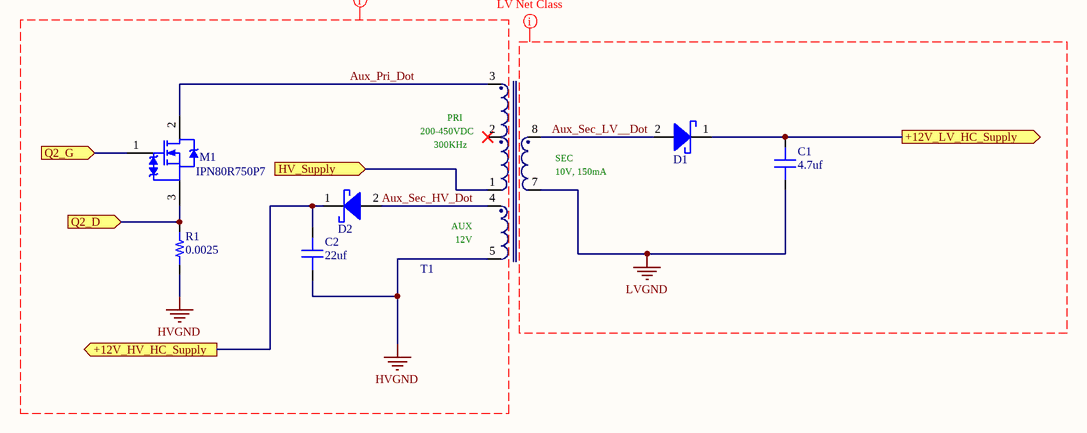
[diagram p5: Flyback Supply.SchDoc]

### Parts
C1  value 4.7uf  [CAP 0805/2012]  (hidden comment: Capacitor MLCC 4.7uf 25V CAP 0805/2012)
C2  value 22uf  [CAP 1206/3216 - 1.8MM]  (hidden comment: Capacitor MLCC 22uf 25V CAP 1206/3216)
D1  BAT46WJ  [SOD323F]  (value not drawn)
D2  BAT46WJ  [SOD323F]  (value not drawn)
M1  AUX Transistor  [PG-SOT223]  (value not drawn)
R1  value 0.0025  [RES 0603/1608]  (hidden comment: RES 0.0025 OHM 1% 1/4W 0603)
T1  Aux Transformer  [750817020]  (value not drawn)

### Ports
+12V_HV_HC_Supply (out), +12V_LV_HC_Supply (out), HV_Supply (in), Q2_D (in), Q2_G (in)

### Nets
+12V_HC_HV: C2.2 D2.1(K) ; port +12V_HV_HC_Supply
+12V_HC_LV: C1.2 D1.1(K) ; port +12V_LV_HC_Supply
HV_IN: T1.1 ; port HV_Supply
HVGND: C2.1 R1.1 T1.5
LVGND: C1.1 T1.7
Aux_Pri_Dot: M1.2(D) T1.3
Aux_Sec_HV_Dot: D2.2(A) T1.4
Aux_Sec_LV__Dot: D1.2(A) T1.8
Q2_D: M1.3(S) R1.2 ; port Q2_D
Q2_G: M1.1(G) ; port Q2_G

Not connected (* = marked no-connect by the designer): T1 2*

### Layout directives
net class LV: Aux_Sec_LV__Dot, LVGND
net class HV: Aux_Pri_Dot, Aux_Sec_HV_Dot, HVGND

### Notes on the sheet
- (in symbol 1) PRI; 300KHz; SEC; 10V, 150mA; AUX; 12V

### Library data of the parts
C1 = 713: as C17 on sheet LT3752-Main; Drawer_id: 1; Voltage_Rating: 25V; Package: CAP 0805/2012; Created_Date: 10/20/2018
C2 = 1092: Manufacturer_id: 1; idCapacitor: 1092; Name: Cap_22uf_25V_CAP 1206/3216; Dielectric: Ceramic; Created_By: Nick Mah; Drawer_id: 1; Voltage_Rating: 25V; Package: CAP 1206/3216; ComponentLink1Description: Datasheet
D1 D2 = 16: Diode Schottky 100V 250mA (DC) Surface Mount SOD-323F; Manufacturer_id: 1; MfrPartNo: BAT46WJ,115; idDiode: 16; Value: Vf=0.3@20mA; Power: 100Vr; Created_By: Nick Mah; Drawer_id: 1; Name: BAT46WJ; Type: Schottky; Num_Circuits: 1; Ic: 250mA; Package: SOD-323F; Link: https://www.digikey.com/product-detail/en/nexperia-usa-inc/BAT46WJ115/1727-4817-1-ND/2531304; ComponentLink1Description: Datasheet; ComponentLink1URL: https://assets.nexperia.com/documents/data-sheet/BAT46WJ.pdf; Supplier1: Digi-Key; Supplier1PartNo: 1727-4817-1-ND
M1 = 14: COOLMOS P7 800V SOT-223; MfrPartNo: IPN80R750P7ATMA1; Manufacturer_id: 1; idFETs: 14; Value: N_Channel; Id: 7A; Rds_On: 750mOhm; Vgs(typ): 10V; Vgs(Max): 20V; Power(Max): 7.2W; Created_By: Nick Mah; Drawer_id: 1; Name: IPN80R750P7; Vdss: 800V; Num_Circuits: 1; Package: PG-SOT223; Link: https://www.digikey.com/product-detail/en/infineon-technologies/IPN80R750P7ATMA1/IPN80R750P7ATMA1TR-ND/8130852; ComponentLink1Description: Datasheet; ComponentLink1URL: https://www.infineon.com/dgdl/Infineon-IPN80R750P7-DS-v02_00-EN.pdf?fileId=5546d4625f2e26bc015f528bca636b84; Supplier1: Digi-Key; Supplier1PartNo: IPN80R750P7ATMA1TR-ND
R1 = 2711: 2.5 mOhms ±1% 0.25W, 1/4W Chip Resistor 0603 (1608 Metric) Automotive AEC-Q200, Current Sense, Moisture Resistant Metal Foil; Manufacturer_id: 1; idResistor: 2711; Name: CSRF0603FT2L50; Created_By: Nick Mah; Supplier 1: Digi-Key; Supplier Part Number 1: CSRF0603FT2L50CT-ND; Drawer_id: 1; Tolerance: 1%; Power: 1/4W; Package: 0603; MfrPartNo: CSRF0603FT2L50; Link: https://www.digikey.com/product-detail/en/stackpole-electronics-inc/CSRF0603FT2L50/CSRF0603FT2L50CT-ND/5798089; ComponentLink1Description: Datasheet; ComponentLink1URL: https://www.seielect.com/catalog/sei-csrf.pdf
T1 = 1: Auxilliary Transformer for DC-DC Senior Project; idTransformer: 1; Name: 500W DC-DC Aux Trfrmr; Value: 4mH - 9.33:1:1.17; Current_Rating: 100mA; Tolerance: 10%; Voltage_Primary: 200-450VDC; Voltage_Secondary: 10VDC; Manufacturer_id: 1; Drawer_id: 1; Package: Through Hole; MfrPartNo: 750817020; Link: https://katalog.we-online.com/en/ctm/MID-OLLT/S/750817020?m=n&sq=750817020&sp=https%3A%2F%2Fwww.we-online.com%2Fweb%2Fen%2Fwuerth_elektronik%2Fsearchpage.php%3Fsearch%3D750817020#vs_ct:1; ComponentLink1Description: Datasheet; ComponentLink1URL: https://katalog.we-online.com/ctm/datasheet/750817020.pdf

## Sheet Forward Active Supply.SchDoc
size A
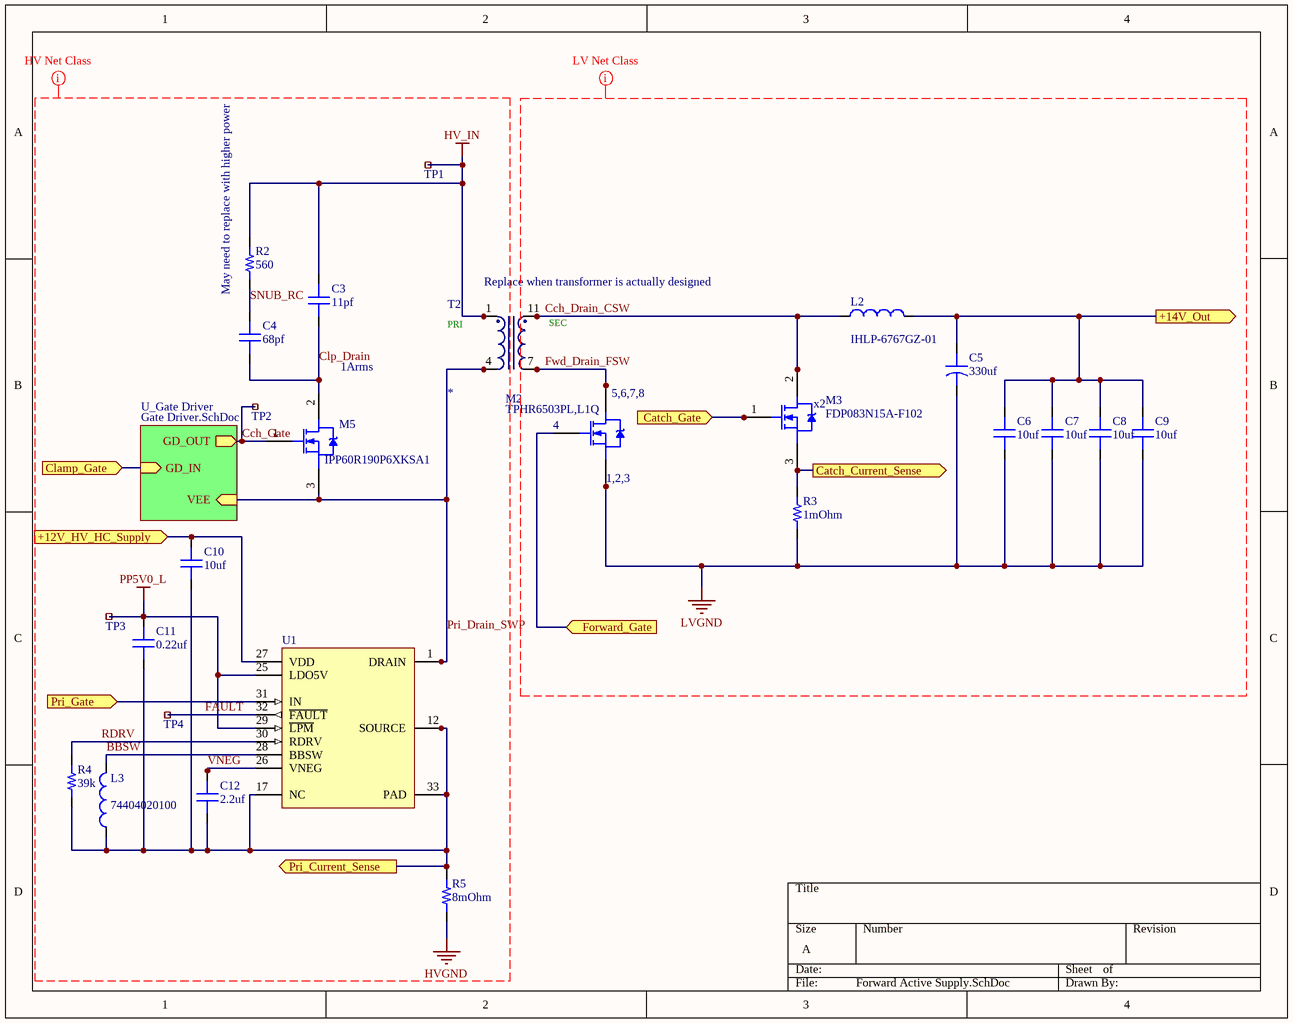
[diagram p6: Forward Active Supply.SchDoc]

### Parts
C3  value 11pf  [CAP 0805/2012]  (hidden comment: Capacitor MLCC 11pf 250V CAP 0805/2012)
C4  value 68pf  [CAP 0805/2012]  (hidden comment: Capacitor MLCC 68pf 200V CAP 0805/2012)
C5  value 330uf  [CAP ALUM 8.3MM]  (hidden comment: Capacitor Aluminum Hybrid Radial 330uf 25V CAP EL 8.3)
C6  value 10uf  [CAP 1206/3216 - 1.8MM]  (hidden comment: Capacitor MLCC 10uf 25V CAP 1206/3216)
C7  value 10uf  [CAP 1206/3216 - 1.8MM]  (hidden comment: Capacitor MLCC 10uf 25V CAP 1206/3216)
C8  value 10uf  [CAP 1206/3216 - 1.8MM]  (hidden comment: Capacitor MLCC 10uf 25V CAP 1206/3216)
C9  value 10uf  [CAP 1206/3216 - 1.8MM]  (hidden comment: Capacitor MLCC 10uf 25V CAP 1206/3216)
C10  value 10uf  [CAP 0603/1608]  (hidden comment: Capacitor MLCC 10uf 16V CAP 0603/1608)
C11  value 0.22uf  [CAP 0603/1608]  (hidden comment: Capacitor MLCC 0.22uf 50V CAP 0603/1608)
C12  value 2.2uf  [CAP 0603/1608]  (hidden comment: Capacitor MLCC 2.2uf 25V CAP 0603/1608)
L2  MfrPartNo: IHLP-6767GZ-01  [IHLP-6767GZ]
L3  (no value)  [74404020100]
M2  MfrPartNo: TPHR6503PL,L1Q  [SOP Advance]  (hidden comment: Forward Mosfet)
M3  MfrPartNo: FDP083N15A-F102  [TO-220ABx2]  (hidden comment: Catch Mosfet x2)
M5  MfrPartNo: IPP60R190P6XKSA1  [IPP60R190P6]  (hidden comment: Clamp Transistor)
R2  value 560  [RES 1206/3216]  (hidden comment: RES 560 OHM 1% 1W 1206)
R3  value 1mOhm  [RES 2010/5025]  (hidden comment: RES 0.001 OHM 1% 1.5W 2010)
R4  value 39k  [RES 0603/1608]  (hidden comment: Resistor 39k 0603 1/10W 1%)
R5  value 8mOhm  [RES 1206/3216]  (hidden comment: RES 0.008 OHM 1% 1W 1206)
T2  (no value)  [B66359]
TP1  RCU-0C  [5029]  (value not drawn)
TP2  RCU-0C  [5029]  (value not drawn)
TP3  RCU-0C  [5029]  (value not drawn)
TP4  RCU-0C  [5029]  (value not drawn)
U1  (no value)  [RWH0032A]

### Sub-sheets
U_Gate Driver = Gate Driver.SchDoc: GD_IN (in), VEE (in), GD_OUT (out)

### Ports
+12V_HV_HC_Supply (in), +14V_Out (out), Catch_Current_Sense (out), Catch_Gate (in), Clamp_Gate (in), Forward_Gate (in), Pri_Current_Sense (out), Pri_Gate (in)

### Nets
+12V_HC_HV: C10.2 U1.27(VDD) ; port +12V_HV_HC_Supply
+14V_OUT: C5.1 C6.2 C7.2 C8.2 C9.2 L2.2 ; port +14V_Out
HV_IN: C3.2 R2.2 T2.1 T2.2 T2.3 TP1.1
HVGND: R5.1
LVGND: C5.2 C6.1 C7.1 C8.1 C9.1 M2.1(S) M2.2(S) M2.3(S) R3.1
PP5V0_L: C11.2 TP3.1 U1.25(LDO5V) U1.29(~{LPM})
BBSW: L3.2 U1.28(BBSW)
Cch_Drain_CSW: L2.1 M3.2(D) M3.5(D) T2.11 T2.12 T2.13
Cch_Drive: M3.1(G) M3.4(G) ; port Catch_Gate
Cch_Gate: M5.1(G) TP2.1 ; sheet U_Gate Driver/GD_OUT
Cch_I_Sense: M3.3(S) M3.6(S) R3.2 ; port Catch_Current_Sense
Clp_Drain: C3.1 C4.1 M5.2(D)
Clp_Gate: port Clamp_Gate, sheet U_Gate Driver/GD_IN
FAULT: TP4.1 U1.32(~{FAULT})
Fwd_Drain_FSW: M2.5(D) M2.6(D) M2.7(D) M2.8(D) T2.7 T2.8 T2.9 T2.10
Fwd_Drive: M2.4(G) ; port Forward_Gate
Pri_Current_Sense: C10.1 C11.1 C12.2 L3.1 R4.1 R5.2 U1.12(SOURCE) U1.13(SOURCE) U1.14(SOURCE) U1.15(SOURCE) U1.16(SOURCE) U1.17(NC) U1.18(SOURCE) U1.19(SOURCE) U1.20(SOURCE) U1.21(SOURCE) U1.22(SOURCE) U1.23(SOURCE) U1.24(SOURCE) U1.33(PAD) ; port Pri_Current_Sense
Pri_Drain_SWP: M5.3(S) T2.4 T2.5 T2.6 U1.1(DRAIN) U1.2(DRAIN) U1.3(DRAIN) U1.4(DRAIN) U1.5(DRAIN) U1.6(DRAIN) U1.7(DRAIN) U1.8(DRAIN) U1.9(DRAIN) U1.10(DRAIN) U1.11(DRAIN) ; sheet U_Gate Driver/VEE
Pri_Gate: U1.31(IN) ; port Pri_Gate
RDRV: R4.2 U1.30(RDRV)
SNUB_RC: C4.2 R2.1
VNEG: C12.1 U1.26(VNEG)

### Layout directives
net class HV: BBSW, Cch_Gate, Clp_Drain, FAULT, HV_IN, HVGND, PP5V0_L, Pri_Drain_SWP, RDRV, SNUB_RC, VNEG
net class LV: Cch_Drain_CSW, Fwd_Drain_FSW, LVGND

### Notes on the sheet
- (near R2) May need to replace with higher power
- (near T2) Replace when transformer is actually designed
- 1Arms
- (in symbol 3) PRI; SEC
- (in symbol 18) 5,6,7,8; 1,2,3
- (in symbol 22) x2

### Library data of the parts
C3 = 1086: Manufacturer_id: 1; idCapacitor: 1086; Name: Cap_11pf_200V_CAP 0805/2012; Dielectric: Ceramic; Tolerance: 2%; Created_By: Nick Mah; Drawer_id: 1; Voltage_Rating: 250V; Package: CAP 0805/2012; ComponentLink1Description: Datasheet
C4 = 1085: Manufacturer_id: 1; idCapacitor: 1085; Name: Cap_68pf_200V_CAP 0805/2012; Dielectric: Ceramic; Tolerance: 5%; Created_By: Nick Mah; Drawer_id: 1; Voltage_Rating: 200V; Package: CAP 0805/2012; ComponentLink1Description: Datasheet
C5 = 1087: Null; Manufacturer_id: 1; MfrPartNo: EEH-ZA1E221P; idCapacitor: 1087; Name: Cap_330uf_25V_CAP EL 8.3; Tolerance: 20%; ESR: 0.027; Created_By: Jason Zhou; Supplier 1: Digi-Key; Supplier Part Number 1: P15437CT-ND; Drawer_id: 1; Voltage_Rating: 25V; Dielectric: Hybrid; Package: EL 8.3; Link: https://www.digikey.com/product-detail/en/panasonic-electronic-components/EEH-ZA1E221P/P15437CT-ND/3088149; ComponentLink1Description: Datasheet; Created_Date: 4/10/2019; ComponentLink1URL: https://industrial.panasonic.com/cdbs/www-data/pdf/RDD0000/ABA0000C1221.pdf; Updated_By: Jason Zhou; Updated_Date: 4/22/2019
C6-C9 = 1088: Manufacturer_id: 1; MfrPartNo: C3216X7R1E106K160AB; idCapacitor: 1088; Name: Cap_10uf_25V_CAP 1206/3216; Dielectric: Ceramic; Tolerance: 10%; Created_By: Jason Zhou; Drawer_id: 1; Voltage_Rating: 25V; Package: CAP 1206/3216; Link: https://www.digikey.com/product-detail/en/tdk-corporation/C3216X7R1E106K160AB/445-7705-1-ND/2733777; ComponentLink1Description: Datasheet; Created_Date: 4/10/2019; Supplier 1: Digi-Key; Supplier Part Number 1: 445-7705-1-ND; ComponentLink1URL: https://product.tdk.com/info/en/catalog/datasheets/mlcc_commercial_general_en.pdf
C10 = 235: Manufacturer_id: 1; idCapacitor: 235; Name: Cap_10uf_16V_CAP 0603/1608; Dielectric: Ceramic; Created_By: Nick Mah; Drawer_id: 1; Voltage_Rating: 16V; Package: CAP 0603/1608; Created_Date: 10/20/2018
C11 = 945: Manufacturer_id: 1; idCapacitor: 945; Name: Cap_0.22uf_50V_CAP 0603/1608; Dielectric: Ceramic; Created_By: Nick Mah; Drawer_id: 1; Voltage_Rating: 50V; Package: CAP 0603/1608; Created_Date: 10/20/2018
C12 = 591: Manufacturer_id: 1; idCapacitor: 591; Name: Cap_2.2uf_25V_CAP 0603/1608; Dielectric: Ceramic; Created_By: Nick Mah; Drawer_id: 1; Voltage_Rating: 25V; Package: CAP 0603/1608; Created_Date: 10/20/2018
L2 = 8: 1.5µH Shielded Molded Inductor 42A 1.88mOhm Max Nonstandard; Manufacturer_id: 1; idInductor: 8; Value: 1.5uH; Tolerance: 20%; Created_By: Jason Zhou; Drawer_id: 1; Name: IHLP-6767GZ-01; Current_Rating: 42A; DC_Resistance: 1.88mOhm; Package: Nonstandard; Link: https://www.digikey.com/product-detail/en/vishay-dale/IHLP6767GZER1R5M01/541-1251-1-ND/2025141; ComponentLink1Description: Datasheet; ComponentLink1URL: http://www.vishay.com/docs/34000/ihlp-6767gz-01.pdf; Supplier1: Digi-Key; Supplier1PartNo: 541-1251-1-ND; Created_Date: 4/22/2019
L3 = 7: 10µH Shielded Wirewound Inductor 500mA 850mOhm Nonstandard; Manufacturer_id: 1; idInductor: 7; Value: 10uH; Current_Rating: 0.5A; Tolerance: 20%; SRF: 39MHz; Created_By: Jason Zhou; MfrPartNo: 74404020100; Drawer_id: 1; Name: 74404020100; DC_Resistance: 850mOhm; Package: Nonstandard; Link: https://www.digikey.com/product-detail/en/wurth-electronics-inc/74404020100/732-10745-1-ND/6598179; ComponentLink1Description: Datasheet; ComponentLink1URL: https://katalog.we-online.de/pbs/datasheet/74404020100.pdf; Supplier1: Digi-Key; Supplier1PartNo: 732-10745-1-ND; Created_Date: 4/18/2019
M2 = 18: N-Channel 30V 150A (Tc) 960mW (Ta), 170W (Tc) Surface Mount 8-SOP Advance (5x5); Manufacturer_id: 1; idFETs: 18; Value: N_Channel; Rds_On: 65mOhm; Vgs(typ): 10V; Vgs(Max): 20V; Created_By: Nick Mah; Drawer_id: 1; Name: TPHR6503PL; Vdss: 30V; Num_Circuits: 1; Id: 150A; Power(Max): 170W; Package: SOP Advance; Link: https://www.digikey.com/product-detail/en/toshiba-semiconductor-and-storage/TPHR6503PLL1Q/TPHR6503PLL1QCT-ND/6099957; ComponentLink1Description: Datasheet; ComponentLink1URL: https://toshiba.semicon-storage.com/info/docget.jsp?did=35760&prodName=TPHR6503PL; Supplier1: Digi-Key; Supplier1PartNo: TPHR6503PLL1QCT-ND
M3 = 22: N-Channel 150V 83A (Tc) 294W (Tc) Through Hole TO-220-3; Manufacturer_id: 1; idFETs: 22; Value: N_Channel x2; Rds_On: 8.3mOhm; Vgs(typ): 10V; Vgs(Max): 20V; Drawer_id: 1; Name: FDP083N15Ax2; Vdss: 150V; Num_Circuits: 1; Id: 83A; Power(Max): 294W; Package: TO-220ABx2; Link: https://www.digikey.com/product-detail/en/on-semiconductor/FDP083N15A-F102/FDP083N15A-F102-ND/3137187; ComponentLink1Description: Datasheet; ComponentLink1URL: https://www.onsemi.com/pub/Collateral/FDP083N15A-D.pdf; Supplier1: Digi-Key; Supplier1PartNo: FDP083N15A-F102-ND
M5 = 16: N-Channel 600V 20.2A (Tc) 151W (Tc) Through Hole PG-TO220-3; Manufacturer_id: 1; idFETs: 16; Value: N_Channel; Id: 20.2; Rds_On: 190mOhm; Vgs(typ): 10V; Vgs(Max): 20V; Created_By: Nick Mah; Drawer_id: 1; Name: IPP60R190P6; Vdss: 600V; Num_Circuits: 1; Power(Max): 151W; Package: TO-220; Link: https://www.digikey.com/products/en?keywords=IPP60R190P6; ComponentLink1Description: Datasheet; ComponentLink1URL: https://www.infineon.com/dgdl/DS_IPP60R190P6_2_0_Approved.pdf?folderId=db3a3043156fd5730115c736bcc70ff2&fileId=db3a30433f2e70c5013f37a818ba23e7; Supplier1: Digi-Key; Supplier1PartNo: IPP60R190P6XKSA1-ND
R2 = 2712: Manufacturer_id: 1; idResistor: 2712; Name: Res_560_1206_1W_5%; Tolerance: 5%; Created_By: Nick Mah; Supplier 1: Digi-Key; Supplier Part Number 1: Digi-Key; Drawer_id: 1; Power: 1W; Package: 1206; ComponentLink1Description: Datasheet
R3 = 2713: 1 mOhms ±1% 1.5W Chip Resistor 2010 (5025 Metric) Current Sense, Moisture Resistant Metal Foil; Manufacturer_id: 1; MfrPartNo: TLR2H15DR001FTDG; idResistor: 2713; Name: Res_0.001_2010_1.5W_1%; Created_By: Nick Mah; Supplier 1: Digi-Key; Supplier Part Number 1: A138745CT-ND; Drawer_id: 1; Tolerance: 1%; Power: 1.5W; Package: 2010; Link: https://www.digikey.com/product-detail/en/te-connectivity-passive-product/TLR2H15DR001FTDG/A138745CT-ND/9372146; ComponentLink1Description: Datasheet; ComponentLink1URL: https://www.te.com/commerce/DocumentDelivery/DDEController?Action=srchrtrv&DocNm=1773449-3&DocType=DS&DocLang=English
R4 = 327: Manufacturer_id: 1; idResistor: 327; Name: Res_39k_0603_1/10W_1%; Created_By: Nick Mah; Supplier 1: Digi-Key; Drawer_id: 1; Tolerance: 1%; Power: 1/10W; Package: 0603; ComponentLink1Description: Datasheet; Created_Date: 2018-10-20
R5 = 2710: 8 mOhms ±1% 1W Chip Resistor 1206 (3216 Metric) Automotive AEC-Q200, Current Sense Thick Film; Manufacturer_id: 1; idResistor: 2710; Name: PMR18EZPFU8L00; Created_By: Nick Mah; Supplier 1: Digi-Key; Supplier Part Number 1: RHM.008ALCT-ND; Drawer_id: 1; Tolerance: 1%; Power: 1W; Package: 1206; MfrPartNo: PMR18EZPFU8L00; Link: https://www.digikey.com/product-detail/en/rohm-semiconductor/PMR18EZPFU8L00/RHM.008ALCT-ND/2094241; ComponentLink1Description: Datasheet; ComponentLink1URL: https://www.rohm.com/datasheet/PMR18EZPFV/pmr-e
T2 = 3: Manufacturer_id: 1; idTransformer: 3; Name: 500W DC-DC Main Trfrmr; Value: 200uH x:x; Voltage_Primary: 200-450VDC; Voltage_Secondary: 45-95VDC; MfrPartNo: *; Drawer_id: 1
TP1-TP4 = 28: as TP8 on sheet LT3752-Main; Drawer_id: 1; Name: 5029; Num_Contacts: 1; Num_Rows: 1; Package: 5029; MfrPartNo: 5029; Link: https://www.digikey.com/product-detail/en/keystone-electronics/5029/36-5029CT-ND/5980631; ComponentLink1Description: Datasheet; ComponentLink1URL: file:///C:/Users/Jason%20Zhou/Downloads/5029.PDF; Supplier1: Digi-Key; Supplier1PartNo: 36-5029CT-ND; Created_Date: 4/26/2019
U1 = 19: N-Channel 600-V 50mOhm GaN with integrated driver and protection; Manufacturer_id: 1; MfrPartNo: XLMG3410R050RWHT; idFETs: 19; Value: N_Channel; Vdss: 600V; Id: 12A; Created_By: Jason Zhou; Drawer_id: 1; Name: LMG3410R050; Num_Circuits: 1; Rds_On: 50mOhm; Package: VQFN RWH; Link: http://www.ti.com/product/LMG3410R050?qgpn=lmg3410r050; ComponentLink1Description: Datasheet; ComponentLink1URL: http://www.ti.com/lit/ds/symlink/lmg3410r050.pdf; Created_Date: 4/18/2019

## Sheet Gate Driver.SchDoc
size A
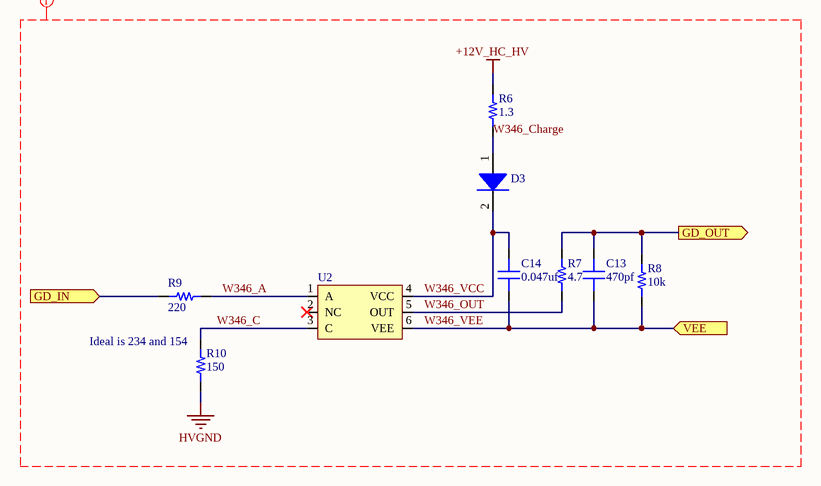
[diagram p7: Gate Driver.SchDoc]

### Parts
C13  value 470pf  [CAP 0603/1608]  (hidden comment: Capacitor MLCC 470pf 50V CAP 0603/1608)
C14  value 0.047uf  [CAP 1210/3225 - 1.6MM]  (hidden comment: Capacitor MLCC 50.047uf 630V CAP 1210/3225)
D3  (no value)  [SMA]
R6  value 1.3  [RES 1206/3216]  (hidden comment: RES 1.3 OHM 1% 1/4W 1206)
R7  value 4.7  [RES 0805/2012]  (hidden comment: Resistor 4.7 0805 1/4W 1%)
R8  value 10k  [RES 0603/1608]  (hidden comment: Resistor 10k 0603 1/10W 1%)
R9  value 220  [RES 0603/1608]  (hidden comment: Resistor 220 0603 1/10W 5%)
R10  value 150  [RES 0603/1608]  (hidden comment: Resistor 150 0603 1/10W 5%)
U2  (no value)  [SOIC-6 (8-mm Clearance)]

### Ports
GD_IN (in), GD_OUT (out), VEE (in)

### Nets
+12V_HC_HV: R6.2
HVGND: R10.1
Cch_Gate: C13.2 R7.2 R8.2 ; port GD_OUT
Clp_Gate: R9.1 ; port GD_IN
W346_A: R9.2 U2.1(A)
W346_C: R10.2 U2.3(C)
W346_Charge: D3.1(A) R6.1
W346_OUT: R7.1 U2.5(OUT)
W346_VCC: C14.2 D3.2(K) U2.4(VCC)
W346_VEE: C13.1 C14.1 R8.1 U2.6(VEE) ; port VEE  [project net Pri_Drain_SWP]

Not connected (* = marked no-connect by the designer): U2 2(NC)*

### Layout directives
net class HV: +12V_HC_HV, HVGND, W346_A, W346_C, W346_Charge, W346_OUT, W346_VCC, W346_VEE

### Notes on the sheet
- (near R10) Ideal is 234 and 154

### Library data of the parts
C13 = 905: Manufacturer_id: 1; idCapacitor: 905; Name: Cap_470pf_50V_CAP 0603/1608; Dielectric: Ceramic; Created_By: Nick Mah; Drawer_id: 1; Voltage_Rating: 50V; Package: CAP 0603/1608; Created_Date: 10/20/2018
C14 = 1091: Manufacturer_id: 1; idCapacitor: 1091; Name: Cap_0.047uf_630V_CAP 1210/3225; Dielectric: Ceramic; Created_By: Nick Mah; Drawer_id: 1; Voltage_Rating: 630V; Package: CAP 1210/3225; ComponentLink1Description: Datasheet
D3 = 17: Diode Standard 1000V 1A Surface Mount SMA; mfrpartno: RS1MTR; Manufacturer_id: 1; idDiode: 17; Power: 1000Vr; Created_By: Nick; Drawer_id: 1; Name: RS1MTR; Value: 1A; Type: Standard; Num_Circuits: 1; Ic: 1A; Package: SMA; Link: https://www.digikey.com/product-detail/en/smc-diode-solutions/RS1MTR/1655-1501-1-ND/6022946; ComponentLink1Description: Datasheet; ComponentLink1URL: http://www.smc-diodes.com/propdf/RS1A-RS1M%20N0988%20REV.B.pdf; Supplier1: Digi-Key; Supplier1PartNo: 1655-1501-1-ND
R6 = 2714: 1.3 Ohms ±1% 0.25W, 1/4W Chip Resistor 1206 (3216 Metric)  Thick Film; Manufacturer_id: 1; MfrPartNo: MCR18ERTFL1R30; idResistor: 2714; Name: Res_1.3_1206_1/4W_1%; Created_By: Nick Mah; Supplier 1: Digi-Key; Supplier Part Number 1: RHM1.30CJCT-ND; Drawer_id: 1; Tolerance: 1%; Power: 1/4W; Package: 1206; Link: https://www.digikey.com/product-detail/en/rohm-semiconductor/MCR18ERTFL1R30/RHM1.30CJCT-ND/2796563; ComponentLink1Description: Datasheet; ComponentLink1URL: https://media.digikey.com/pdf/Compliance/Rohm/MCR18ERT_Material.pdf
R7 = 665: Manufacturer_id: 1; idResistor: 665; Name: Res_4.7_0805_1/4W_1%; Created_By: Nick Mah; Supplier 1: Digi-Key; Drawer_id: 1; Tolerance: 1%; Power: 1/4W; Package: 0805; ComponentLink1Description: Datasheet; Created_Date: 2018-10-20
R8 = 313: as R11 on sheet LT3752-Main; Supplier 1: Digi-Key; Drawer_id: 1; Tolerance: 1%; Power: 1/10W; Package: 0603; ComponentLink1Description: Datasheet; Created_Date: 2018-10-20
R9 = 1353: Manufacturer_id: 1; idResistor: 1353; Name: Res_220_0603_1/10W_5%; Created_By: Nick Mah; Supplier 1: Digi-Key; Drawer_id: 1; Tolerance: 5%; Power: 1/10W; Package: 0603; ComponentLink1Description: Datasheet; Created_Date: 2018-10-20
R10 = 1349: Manufacturer_id: 1; idResistor: 1349; Name: Res_150_0603_1/10W_5%; Created_By: Nick Mah; Supplier 1: Digi-Key; Drawer_id: 1; Tolerance: 5%; Power: 1/10W; Package: 0603; ComponentLink1Description: Datasheet; Created_Date: 2018-10-20
U2 = 5: OPTOISO 5KV 1CH GATE DRIVER 6SO; Manufacturer_id: 1; idPMIC_SW: 5; Power: 2.5A; Topology: Bootstrapped Gate Drive; Vin(Min): 10V; Vin(Max): 20V; Vout(Min): 0; Vout(Max): 20; Created_By: Nick; mfrpartno: ACPL-W346; Drawer_id: 1; Name: ACPL-W346; Value: Gate Driver; Output_Config: 1; Num_Outputs: 1; Current_Rating: 2.5A; Package: SOIC-6 Stretched; Link: https://www.digikey.com/product-detail/en/broadcom-limited/ACPL-W346-500E/516-3743-1-ND/6823064; ComponentLink1Description: Datasheet; ComponentLink1URL: https://docs.broadcom.com/docs/AV02-4078EN; Supplier1: Digi-Key; Supplier1PartNo: 516-3743-1-ND